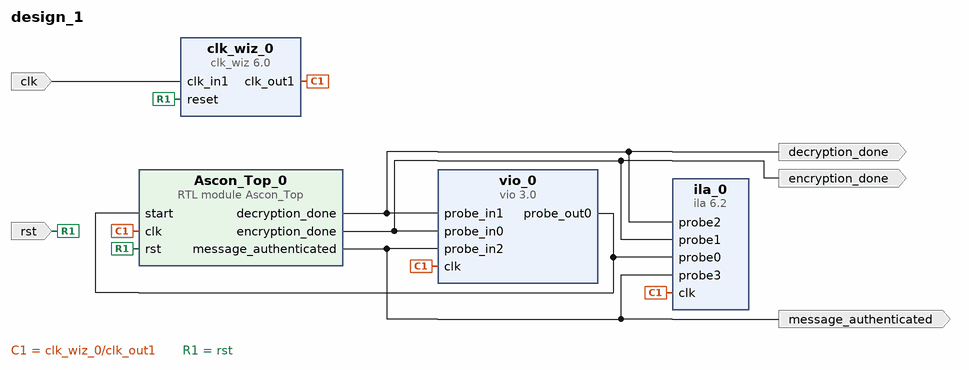
[diagram p0: block diagram of the top level]
# Vivado block design design_1, xc7a100ticsg324-1L, Vivado 2023.2
create_bd_design design_1

create_bd_port -dir I -type clk clk
create_bd_port -dir I -type rst rst
set_property -dict {CONFIG.POLARITY ACTIVE_HIGH} [get_bd_ports rst]
create_bd_port -dir O decryption_done
create_bd_port -dir O encryption_done
create_bd_port -dir O message_authenticated

create_bd_cell -type ip -vlnv xilinx.com:ip:ila:6.2 ila_0
set_property -dict {CONFIG.C_MONITOR_TYPE Native CONFIG.C_NUM_OF_PROBES 4} [get_bd_cells ila_0]
create_bd_cell -type module -reference Ascon_Top Ascon_Top_0
create_bd_cell -type ip -vlnv xilinx.com:ip:vio:3.0 vio_0
set_property -dict {CONFIG.C_NUM_PROBE_IN 3} [get_bd_cells vio_0]
create_bd_cell -type ip -vlnv xilinx.com:ip:clk_wiz:6.0 clk_wiz_0

# ---- connections ----

connect_bd_net [get_bd_pins Ascon_Top_0/decryption_done] [get_bd_ports decryption_done] [get_bd_pins ila_0/probe2] [get_bd_pins vio_0/probe_in1]
connect_bd_net [get_bd_pins Ascon_Top_0/encryption_done] [get_bd_ports encryption_done] [get_bd_pins ila_0/probe1] [get_bd_pins vio_0/probe_in0]
connect_bd_net [get_bd_pins Ascon_Top_0/message_authenticated] \
  [get_bd_ports message_authenticated] [get_bd_pins ila_0/probe3] [get_bd_pins vio_0/probe_in2]
connect_bd_net -net clk_in1_0_1 [get_bd_ports clk] [get_bd_pins clk_wiz_0/clk_in1]
connect_bd_net [get_bd_pins clk_wiz_0/clk_out1] [get_bd_pins vio_0/clk] [get_bd_pins ila_0/clk] [get_bd_pins Ascon_Top_0/clk]
connect_bd_net -net reset_0_1 [get_bd_ports rst] [get_bd_pins clk_wiz_0/reset] [get_bd_pins Ascon_Top_0/rst]
connect_bd_net [get_bd_pins vio_0/probe_out0] [get_bd_pins ila_0/probe0] [get_bd_pins Ascon_Top_0/start]

validate_bd_design
save_bd_design
